# Altium schematic sheet DB36_Hardware_Kit.SchDoc: DB36 Hardware Kit
size A4; Organization: Altium Limited.; Address1: Level 3, 12a Rodborough Rd; Address2: Frenchs Forest 2086; Address3: NSW; Address4: AUSTRALIA; DocumentNumber: 9; SheetNumber: 9; SheetTotal: 23
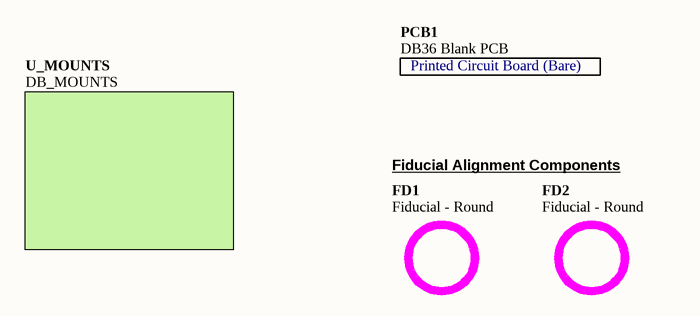
[diagram p0: DB36_Hardware_Kit.SchDoc]

## Parts
FD1  Fiducial - Round  [FIDUCIAL ROUND]
FD2  Fiducial - Round  [FIDUCIAL ROUND]
PCB1  DB36 Blank PCB  [DB36 Blank PCB]

## Sub-sheets
U_MOUNTS = DB_MOUNTS: no entries

## Notes on the sheet
- Fiducial Alignment Components
- Sheet Title
- Project Title
- Size:
- Date:
- A4
- Assy:
- Time:
- Revision:
- Sheet
- of
- File:
- (in symbol D-810-0010) Printed Circuit Board (Bare)

## Library data of the parts
FD1 FD2 = D-000-0005: Fiducial - Round 1.5mm Top-Bottom; Status: Unreleased; Category: Graphic-PCB
PCB1 = D-810-0010: DB36 Blank PCB - Daughter Board Xilinx Virtex4 XC4VLX25FF668; ProjectPath: DB36.PrjPCB; Status: Unreleased; Category: Blank PCB